# Altium project LeoBlinky2018-ENT.PrjPCB
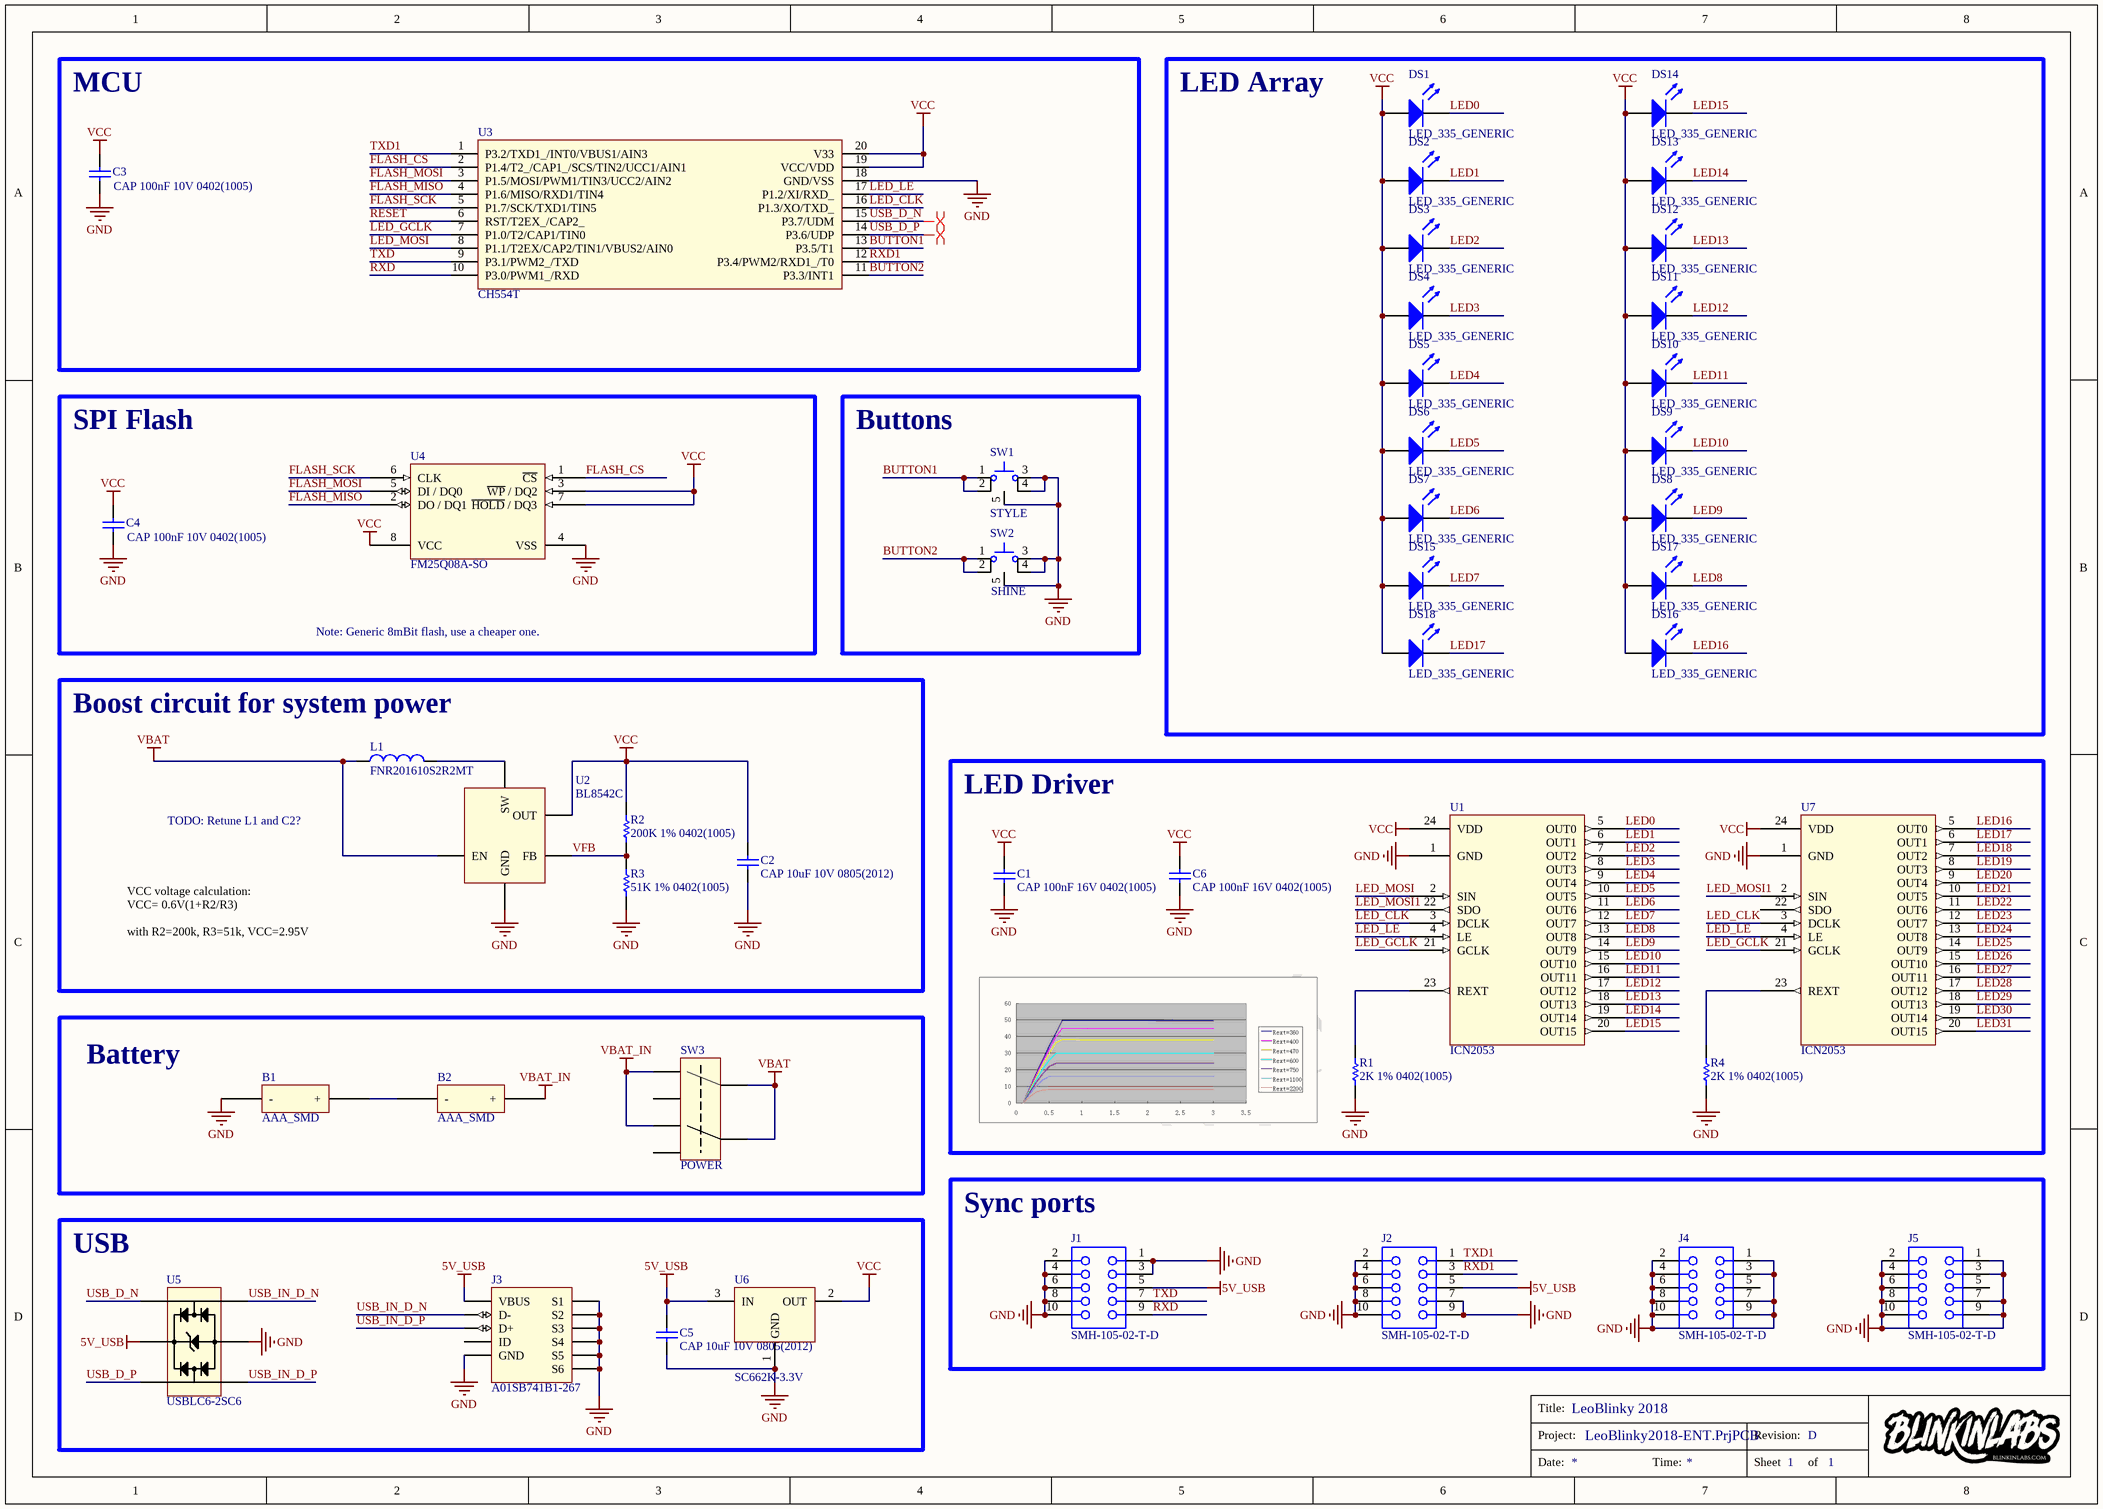
[diagram p0: LeoBlinky2018-ENT.SchDoc]
1 sheet, 46 parts. Net scope: global (net labels, ports and power ports of the same name join across sheets).
Board file: LeoBlinky2018-ENT.PcbDoc

## Sheet LeoBlinky2018-ENT.SchDoc: LeoBlinky 2018
size A3; Organization: Blinkinlabs, LLC; DocumentNumber: 1; Revision: D; SheetNumber: 1; SheetTotal: 1

### Parts
B1  AAA_SMD  [AAA_SMD]
B2  AAA_SMD  [AAA_SMD]
C1  CAP 100nF 16V 0402(1005)  [CAPC0402(1005)60_N]
C2  CAP 10uF 10V 0805(2012)  [CAPC0805(2012)145_N]
C3  CAP 100nF 10V 0402(1005)  [CAPC0402(1005)60_L]
C4  CAP 100nF 10V 0402(1005)  [CAPC0402(1005)60_L]
C5  CAP 10uF 10V 0805(2012)  [CAPC0805(2012)145_N]
C6  CAP 100nF 16V 0402(1005)  [CAPC0402(1005)60_N]
DS1  LED_335_GENERIC  [LED_335_GENERIC]
DS2  LED_335_GENERIC  [LED_335_GENERIC]
DS3  LED_335_GENERIC  [LED_335_GENERIC]
DS4  LED_335_GENERIC  [LED_335_GENERIC]
DS5  LED_335_GENERIC  [LED_335_GENERIC]
DS6  LED_335_GENERIC  [LED_335_GENERIC]
DS7  LED_335_GENERIC  [LED_335_GENERIC]
DS8  LED_335_GENERIC  [LED_335_GENERIC]
DS9  LED_335_GENERIC  [LED_335_GENERIC]
DS10  LED_335_GENERIC  [LED_335_GENERIC]
DS11  LED_335_GENERIC  [LED_335_GENERIC]
DS12  LED_335_GENERIC  [LED_335_GENERIC]
DS13  LED_335_GENERIC  [LED_335_GENERIC]
DS14  LED_335_GENERIC  [LED_335_GENERIC]
DS15  LED_335_GENERIC  [LED_335_GENERIC]
DS16  LED_335_GENERIC  [LED_335_GENERIC]
DS17  LED_335_GENERIC  [LED_335_GENERIC]
DS18  LED_335_GENERIC  [LED_335_GENERIC]
J1  SMH-105-02-T-D  [SMTC-SMH-105-02-X-D]
J2  SMH-105-02-T-D  [SMTC-SMH-105-02-X-D]
J3  A01SB741B1-267  [A01SB741B1-267]
J4  SMH-105-02-T-D  [SMTC-SMH-105-02-X-D]
J5  SMH-105-02-T-D  [SMTC-SMH-105-02-X-D]
L1  FNR201610S2R2MT  [FNR201610S]
R1  2K 1% 0402(1005)  [RESC0402(1005)_N]
R2  200K 1% 0402(1005)  [RESC0402(1005)_L]
R3  51K 1% 0402(1005)  [RESC0402(1005)_L]
R4  2K 1% 0402(1005)  [RESC0402(1005)_N]
SW1  STYLE  [TD-07XB]
SW2  SHINE  [TD-07XB]
SW3  POWER  [MSK-1133-NOHOLE]
U1  ICN2053  [SOP64P600X175-24N]
U2  BL8542C  [SOT95P280X130-5N]
U3  CH554T  [TSOP65P660X110-20N]
U4  FM25Q08A-SO  [SOP127P600X175-8N]
U5  USBLC6-2SC6  [SOT95P280X145-6N]
U6  SC662K-3.3V  [SOT95P230X117-3N]
U7  ICN2053  [SOP64P600X175-24N]

### Blocks framed on the sheet
MCU: C3 U3
LED Array: DS1-DS18
SPI Flash: C4 U4
Buttons: SW1 SW2
Boost circuit for system power: C2 L1 R2 R3 U2
LED Driver: C1 C6 R1 R4 U1 U7
Battery: B1 B2 SW3
Sync ports: J1 J2 J4 J5
USB: C5 J3 U5 U6

### Nets
5V_USB: C5.2 J1.5 J2.5 J3.VBUS U5.5 U6.3(IN)
GND: B1.2(-) C1.1 C2.1 C3.1 C4.1 C5.1 C6.1 J1.1 J1.2 J1.3 J1.4 J1.6 J1.8 J1.10 J2.2 J2.4 J2.6 J2.7 J2.8 J2.9 J2.10 J3.GND J3.S1 J3.S2 J3.S3 J3.S4 J3.S5 J3.S6 J4.1 J4.2 J4.3 J4.4 J4.6 J4.7 J4.8 J4.9 J4.10 J5.1 J5.2 J5.3 J5.4 J5.6 J5.7 J5.8 J5.9 J5.10 R1.1 R3.1 R4.1 SW1.3 SW1.4 SW1.5 SW2.3 SW2.4 SW2.5 U1.1(GND) U2.2(GND) U3.18(GND/VSS) U4.4(VSS) U5.2(GND) U6.1(GND) U7.1(GND)
VBAT: L1.1 SW3.2 SW3.5 U2.3(EN)
VBAT_IN: B2.1(+) SW3.1(A) SW3.6
VCC: C1.2 C2.2 C3.2 C4.2 C6.2 DS1.2 DS2.2 DS3.2 DS4.2 DS5.2 DS6.2 DS7.2 DS8.2 DS9.2 DS10.2 DS11.2 DS12.2 DS13.2 DS14.2 DS15.2 DS16.2 DS17.2 DS18.2 R2.2 U1.24(VDD) U2.5(OUT) U3.19(VCC/VDD) U3.20(V33) U4.3(~{WP}_/_DQ2) U4.7(~{HOLD}_/_DQ3) U4.8(VCC) U6.2(OUT) U7.24(VDD)
BUTTON1: SW1.1 SW1.2 U3.13(P3.5/T1)
BUTTON2: SW2.1 SW2.2 U3.11(P3.3/INT1)
FLASH_CS: U3.2(P1.4/T2_/CAP1_/SCS/TIN2/UCC1/AIN1) U4.1(~{CS})
FLASH_MISO: U3.4(P1.6/MISO/RXD1/TIN4) U4.2(DO_/_DQ1)
FLASH_MOSI: U3.3(P1.5/MOSI/PWM1/TIN3/UCC2/AIN2) U4.5(DI_/_DQ0)
FLASH_SCK: U3.5(P1.7/SCK/TXD1/TIN5) U4.6(CLK)
LED0: DS1.1 U1.5(OUT0)
LED1: DS2.1 U1.6(OUT1)
LED2: DS3.1 U1.7(OUT2)
LED3: DS4.1 U1.8(OUT3)
LED4: DS5.1 U1.9(OUT4)
LED5: DS6.1 U1.10(OUT5)
LED6: DS7.1 U1.11(OUT6)
LED7: DS15.1 U1.12(OUT7)
LED8: DS17.1 U1.13(OUT8)
LED9: DS8.1 U1.14(OUT9)
LED10: DS9.1 U1.15(OUT10)
LED11: DS10.1 U1.16(OUT11)
LED12: DS11.1 U1.17(OUT12)
LED13: DS12.1 U1.18(OUT13)
LED14: DS13.1 U1.19(OUT14)
LED15: DS14.1 U1.20(OUT15)
LED16: DS16.1 U7.5(OUT0)
LED17: DS18.1 U7.6(OUT1)
LED18: U7.7(OUT2)
LED19: U7.8(OUT3)
LED20: U7.9(OUT4)
LED21: U7.10(OUT5)
LED22: U7.11(OUT6)
LED23: U7.12(OUT7)
LED24: U7.13(OUT8)
LED25: U7.14(OUT9)
LED26: U7.15(OUT10)
LED27: U7.16(OUT11)
LED28: U7.17(OUT12)
LED29: U7.18(OUT13)
LED30: U7.19(OUT14)
LED31: U7.20(OUT15)
LED_CLK: U1.3(DCLK) U3.16(P1.3/XO/TXD_) U7.3(DCLK)
LED_GCLK: U1.21(GCLK) U3.7(P1.0/T2/CAP1/TIN0) U7.21(GCLK)
LED_LE: U1.4(LE) U3.17(P1.2/XI/RXD_) U7.4(LE)
LED_MOSI: U1.2(SIN) U3.8(P1.1/T2EX/CAP2/TIN1/VBUS2/AIN0)
LED_MOSI1: U1.22(SDO) U7.2(SIN)
RESET: U3.6(RST/T2EX_/CAP2_)
RXD: J1.9 U3.10(P3.0/PWM1_/RXD)
RXD1: J2.3 U3.12(P3.4/PWM2/RXD1_/T0)
TXD: J1.7 U3.9(P3.1/PWM2_/TXD)
TXD1: J2.1 U3.1(P3.2/TXD1_/INT0/VBUS1/AIN3)
USB_D_N: U3.15(P3.7/UDM) U5.4(I/O2)
USB_D_P: U3.14(P3.6/UDP) U5.6(I/O1)
USB_IN_D_N: J3.D- U5.3(I/O2)
USB_IN_D_P: J3.D+ U5.1(I/O1)
VFB: R2.1 R3.2 U2.1(FB)
NetB1_1: B1.1(+) B2.2(-)
NetL1_2: L1.2 U2.4(SW)
NetR1_2: R1.2 U1.23(REXT)
NetR4_2: R4.2 U7.23(REXT)

Not connected (* = marked no-connect by the designer): J3 ID; J4 5; J5 5; SW3 3 4; U7 22(SDO)

### Layout directives
differential pair: USB_D_N, USB_D_P

### Notes on the sheet
- Note: Generic 8mBit flash, use a cheaper one.
- TODO: Retune L1 and C2?
- VCC voltage calculation:
  VCC= 0.6V(1+R2/R3)
  with R2=200k, R3=51k, VCC=2.95V
- Title:
- Project:
- Revision:
- Date:
- Time:
- Sheet
- of

### Library data of the parts
B1 B2 = AAA_SMD: AAA battery holder, surface mount.
C1 C6 = CMP-1034-02071-1: CAP 100nF 16V -20% to +80% 0402 (1005 Metric) Thickness 0.6mm SMD; Case-Metric: 1005; Case-EIA: 0402; Value: 100nF; Rated Voltage: 16 V; Tolerance: -20% to +80%; Technology: SMT; Max Thickness: 0.6 mm
C2 C5 = CMP-1036-04922-1: CAP 10uF 10V ±10% 0805 (2012 Metric) Thickness 1.45mm SMD; Tolerance: Â±10%; Case-EIA: 0805; Case-Metric: 2012; Value: 10uF; Technology: SMT; Rated Voltage: 10 V; Max Thickness: 1.45 mm
C3 C4 = CMP-1034-02065-1: CAP 100nF 10V ±10% 0402 (1005 Metric) Thickness 0.6mm SMD; Case-EIA: 0402; Case-Metric: 1005; Tolerance: Â±10%; Max Thickness: 0.6 mm; Value: 100nF; Rated Voltage: 10 V; Technology: SMT
DS1-DS18 = LED_335_GENERIC: SMD LED, side visible, generic
J1 J2 J4 J5 = CMP-1023-00158-1: SMT Horizontal Socket, -55 to 105 degC, 2.54 mm Pitch, 10-Pin, Female, RoHS; Manufacturer: Samtec; Pitch: 2.54 mm; PackageDescription: .100 [2.54] Horizontal SMT Socket Assembly; ComponentLink2Description: Datasheet; PackageVersion: AF, 2/1999; Orientation: Horizontal; ComponentLink3Description: Package Specification; Mounting Technology: Surface Mount; ComponentLink3URL: http://www.samtec.com/documents/webfiles/cpdf/SMH-1XX-XX-XX-X-XX-MKT.pdf; ComponentLink1Description: Manufacturer URL; RoHS: True; ComponentLink1URL: http://www.samtec.com; ComponentLink2URL: http://www.samtec.com/documents/webfiles/pdf/SMH.PDF; PartNumber: SMH-105-02-T-D; DatasheetVersion: F-214; Temperature Range: -55 to 105 degC; PackageReference: SMH-105-02-X-D
J3 = A01SB741B1-267: Micro USB B type 四脚全插牛角
L1 = FNR201610S2R2MT: Wire Wound SMD Power Inductors 2.0×1.6×1.0 2.2uH
R1 R4 = CMP-1011-00542-1: 2K 0.063W 1% 0402 (1005 Metric)  SMD; Case-EIA: 0402; Case-Metric: 1005; Value: 2000.00 Ohm; Technology: SMT; Power: 0.063 W; Tolerance: 1 %
R2 = CMP-1011-00768-1: 200K 0.063W 1% 0402 (1005 Metric)  SMD; Value: 200000.00 Ohm; Case-Metric: 1005; Case-EIA: 0402; Tolerance: 1 %; Power: 0.063 W; Technology: SMT
R3 = CMP-1011-00703-1: 51K 0.063W 1% 0402 (1005 Metric)  SMD; Case-Metric: 1005; Value: 51000.00 Ohm; Case-EIA: 0402; Technology: SMT; Tolerance: 1 %; Power: 0.063 W
SW1 SW2 = TD-07XB: Tact Switch; Manufacturer: ShenZhen XieJia Electronics Co Ltd; PartNumber: TD-07XB
SW3 = MSK-1133: SMD micro toggle switch, 2 position, 2 circuit
U1 U7 = ICN2053: 16-Channel PWM Constant Current LED Sink Driver; Manufacturer: ChipOne; PartNumber: ICN2053
U2 = BL8542C: 0.85V startup, 1MHz, 300mA Iout,  Synchronous Boost Converter (adjustable output); Manufacturer: Belling; PartNumber: BL8542C
U3 = CH554T: 8-bit enhanced USB microcontroller; Manufacturer: WCH; PartNumber: CH554T
U4 = FM25Q08A-SO: 8M-BIT SERIAL FLASH MEMORY, 150mil width; Manufacturer: Shanghai Fudan Microelectronics Group Company Limited; PartNumber: FM25Q08A-SO
U5 = USBLC6-2SC6: Very low capacitance ESD protection; Manufacturer: STMicroelectronics; ComponentLink2Description: Datasheet; ComponentLink2URL: USBLC6-2.pdf; PartNumber: USBLC6-2SC6
U6 = SC662K-3.3V: 3.3V, 250mA Low dropout voltage regulator IC